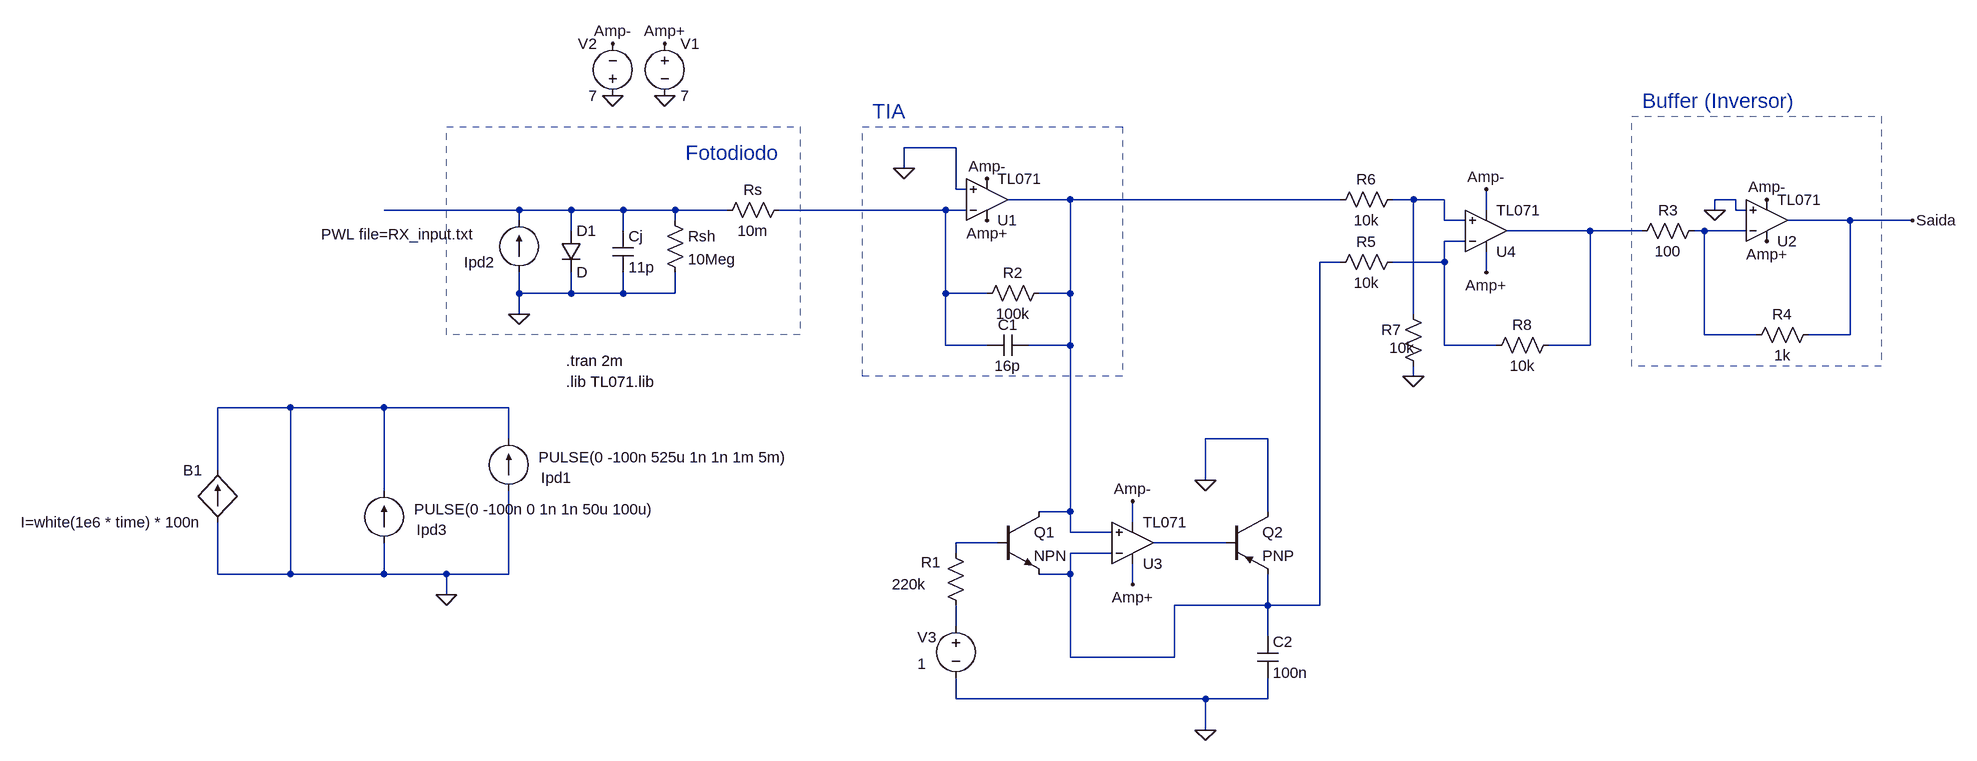
[diagram p0: schematic adaptative_receptor_manual.asc]
adaptative_receptor_manual.asc, the LTspice schematic file:
Version 4
SHEET 1 1100 900
WIRE -1680 -64 -1760 -64
WIRE -1760 -32 -1760 -64
WIRE -1680 0 -1680 -64
WIRE -1664 0 -1680 0
WIRE -1504 16 -1600 16
WIRE -1088 16 -1504 16
WIRE -976 16 -1008 16
WIRE -928 16 -976 16
WIRE -480 16 -512 16
WIRE -2352 32 -2560 32
WIRE -2272 32 -2352 32
WIRE -2192 32 -2272 32
WIRE -2112 32 -2192 32
WIRE -2032 32 -2112 32
WIRE -1696 32 -1952 32
WIRE -1664 32 -1696 32
WIRE -864 32 -864 0
WIRE -512 32 -512 16
WIRE -480 32 -480 16
WIRE -464 32 -480 32
WIRE -2352 48 -2352 32
WIRE -2112 48 -2112 32
WIRE -928 48 -928 16
WIRE -896 48 -928 48
WIRE -304 48 -400 48
WIRE -208 48 -304 48
WIRE -2272 64 -2272 32
WIRE -2192 64 -2192 32
WIRE -704 64 -832 64
WIRE -624 64 -704 64
WIRE -528 64 -544 64
WIRE -464 64 -528 64
WIRE -896 80 -928 80
WIRE -1088 112 -1120 112
WIRE -928 112 -928 80
WIRE -928 112 -1008 112
WIRE -864 128 -864 96
WIRE -2352 160 -2352 128
WIRE -2272 160 -2272 128
WIRE -2272 160 -2352 160
WIRE -2192 160 -2192 128
WIRE -2192 160 -2272 160
WIRE -2112 160 -2112 128
WIRE -2112 160 -2192 160
WIRE -1696 160 -1696 32
WIRE -1632 160 -1696 160
WIRE -1504 160 -1504 16
WIRE -1504 160 -1552 160
WIRE -2352 192 -2352 160
WIRE -976 192 -976 16
WIRE -528 224 -528 64
WIRE -448 224 -528 224
WIRE -304 224 -304 48
WIRE -304 224 -368 224
WIRE -1696 240 -1696 160
WIRE -1632 240 -1696 240
WIRE -1504 240 -1504 160
WIRE -1504 240 -1568 240
WIRE -928 240 -928 112
WIRE -848 240 -928 240
WIRE -704 240 -704 64
WIRE -704 240 -768 240
WIRE -976 288 -976 272
WIRE -2704 336 -2816 336
WIRE -2560 336 -2704 336
WIRE -2368 336 -2560 336
WIRE -2368 384 -2368 336
WIRE -1200 384 -1296 384
WIRE -2816 432 -2816 336
WIRE -1296 448 -1296 384
WIRE -2560 464 -2560 336
WIRE -1504 496 -1504 240
WIRE -1504 496 -1552 496
WIRE -1200 496 -1200 384
WIRE -1408 512 -1408 480
WIRE -1504 528 -1504 496
WIRE -1440 528 -1504 528
WIRE -1616 544 -1680 544
WIRE -1264 544 -1376 544
WIRE -1680 560 -1680 544
WIRE -1440 560 -1504 560
WIRE -2816 592 -2816 512
WIRE -2704 592 -2704 336
WIRE -2704 592 -2816 592
WIRE -2560 592 -2560 544
WIRE -2560 592 -2704 592
WIRE -2464 592 -2560 592
WIRE -2368 592 -2368 464
WIRE -2368 592 -2464 592
WIRE -1504 592 -1504 560
WIRE -1504 592 -1552 592
WIRE -1408 608 -1408 576
WIRE -2464 624 -2464 592
WIRE -1200 640 -1200 592
WIRE -1200 640 -1344 640
WIRE -1120 640 -1120 112
WIRE -1120 640 -1200 640
WIRE -1680 672 -1680 640
WIRE -1200 688 -1200 640
WIRE -1504 720 -1504 592
WIRE -1344 720 -1344 640
WIRE -1344 720 -1504 720
WIRE -1680 784 -1680 752
WIRE -1296 784 -1680 784
WIRE -1200 784 -1200 752
WIRE -1200 784 -1296 784
WIRE -1296 832 -1296 784
FLAG -2128 -224 Amp+
FLAG -2128 -144 0
FLAG -2208 -224 Amp-
FLAG -2208 -144 0
FLAG -1632 48 Amp+
FLAG -1632 -16 Amp-
FLAG -1760 -32 0
FLAG -432 80 Amp+
FLAG -432 16 Amp-
FLAG -512 32 0
FLAG -2352 192 0
FLAG -1408 480 Amp-
FLAG -864 0 Amp-
FLAG -1408 608 Amp+
FLAG -864 128 Amp+
FLAG -976 288 0
FLAG -1296 832 0
FLAG -1296 448 0
FLAG -2464 624 0
FLAG -208 48 Saida
SYMBOL OpAmps\\opamp2 -1632 80 M180
SYMATTR InstName U1
SYMATTR Value TL071
SYMBOL voltage -2128 -240 R0
WINDOW 123 0 0 Left 0
WINDOW 39 0 0 Left 0
SYMATTR InstName V1
SYMATTR Value 7
SYMBOL voltage -2208 -128 R180
WINDOW 0 24 96 Left 2
WINDOW 3 24 16 Left 2
WINDOW 123 0 0 Left 0
WINDOW 39 0 0 Left 0
SYMATTR InstName V2
SYMATTR Value 7
SYMBOL res -1536 144 R90
WINDOW 0 0 56 VBottom 2
WINDOW 3 32 56 VTop 2
SYMATTR InstName R2
SYMATTR Value 100k
SYMBOL res -528 48 R90
WINDOW 0 0 56 VBottom 2
WINDOW 3 32 56 VTop 2
SYMATTR InstName R3
SYMATTR Value 100
SYMBOL OpAmps\\opamp2 -432 112 M180
SYMATTR InstName U2
SYMATTR Value TL071
SYMBOL res -464 240 R270
WINDOW 0 32 56 VTop 2
WINDOW 3 0 56 VBottom 2
SYMATTR InstName R4
SYMATTR Value 1k
SYMBOL diode -2288 64 R0
SYMATTR InstName D1
SYMBOL cap -2208 64 R0
SYMATTR InstName Cj
SYMATTR Value 11p
SYMBOL res -2128 32 R0
SYMATTR InstName Rsh
SYMATTR Value 10Meg
SYMBOL res -1936 16 R90
WINDOW 0 0 56 VBottom 2
WINDOW 3 32 56 VTop 2
SYMATTR InstName Rs
SYMATTR Value 10m
SYMBOL cap -1568 224 R90
WINDOW 0 0 32 VBottom 2
WINDOW 3 32 32 VTop 2
SYMATTR InstName C1
SYMATTR Value 16p
SYMBOL npn -1616 496 R0
SYMATTR InstName Q1
SYMBOL pnp -1264 496 R0
SYMATTR InstName Q2
SYMBOL OpAmps\\opamp2 -1408 608 M180
SYMATTR InstName U3
SYMATTR Value TL071
SYMBOL cap -1216 688 R0
SYMATTR InstName C2
SYMATTR Value 100n
SYMBOL res -1696 544 R0
WINDOW 0 -38 30 Left 2
WINDOW 3 -82 64 Left 2
SYMATTR InstName R1
SYMATTR Value 220k
SYMBOL voltage -1680 656 R0
WINDOW 0 -59 33 Left 2
WINDOW 3 -59 74 Left 2
SYMATTR InstName V3
SYMATTR Value 1
SYMBOL OpAmps\\opamp2 -864 128 M180
SYMATTR InstName U4
SYMATTR Value TL071
SYMBOL res -1104 128 R270
WINDOW 0 32 56 VTop 2
WINDOW 3 0 56 VBottom 2
SYMATTR InstName R5
SYMATTR Value 10k
SYMBOL res -1104 32 R270
WINDOW 0 32 56 VTop 2
WINDOW 3 0 56 VBottom 2
SYMATTR InstName R6
SYMATTR Value 10k
SYMBOL res -992 176 R0
WINDOW 0 -33 40 Left 2
WINDOW 3 -21 68 Left 2
SYMATTR InstName R7
SYMATTR Value 10k
SYMBOL res -752 224 R90
WINDOW 0 0 56 VBottom 2
WINDOW 3 32 56 VTop 2
SYMATTR InstName R8
SYMATTR Value 10k
SYMBOL current -2560 544 R180
WINDOW 3 -46 52 Right 2
WINDOW 123 0 0 Left 0
WINDOW 39 0 0 Left 0
WINDOW 0 -50 20 Right 2
SYMATTR Value PULSE(0 -100n 0 1n 1n 50u 100u)
SYMATTR InstName Ipd3
SYMBOL current -2368 464 R180
WINDOW 3 -46 52 Right 2
WINDOW 123 0 0 Left 0
WINDOW 39 0 0 Left 0
WINDOW 0 -50 20 Right 2
SYMATTR Value PULSE(0 -100n 525u 1n 1n 1m 5m)
SYMATTR InstName Ipd1
SYMBOL bi -2816 512 R180
WINDOW 0 24 80 Left 2
WINDOW 3 24 0 Left 2
SYMATTR InstName B1
SYMATTR Value I=white(1e6 * time) * 100n
SYMBOL current -2352 128 R180
WINDOW 3 305 59 Right 2
WINDOW 123 0 0 Left 0
WINDOW 39 0 0 Left 0
WINDOW 0 85 16 Right 2
SYMATTR Value PWL file=RX_input.txt
SYMATTR InstName Ipd2
TEXT -2280 264 Left 2 !.tran 2m
TEXT -2280 296 Left 2 !.lib TL071.lib
TEXT -2096 -56 Left 3 ;Fotodiodo
TEXT -1808 -120 Left 3 ;TIA
TEXT -624 -136 Left 3 ;Buffer (Inversor)
RECTANGLE Normal -1424 288 -1824 -96 2
RECTANGLE Normal -256 272 -640 -112 2
RECTANGLE Normal -1920 224 -2464 -96 2

The netlist it stands for:
* adaptative_receptor_manual.asc
XU1 0 N004 Amp+ Amp- N001 TL071  ; pins In+ In- V+ V- OUT
V1 Amp+ 0 7
V2 0 Amp- 7
R2 N001 N004 100k
R3 N006 N005 100
XU2 0 N006 Amp+ Amp- Saida TL071  ; pins In+ In- V+ V- OUT
R4 N006 Saida 1k
D1 N003 0 D
Cj N003 0 11p
Rsh N003 0 10Meg
Rs N004 N003 10m
C1 N001 N004 16p
Q1 N001 N009 N008 0 NPN
Q2 0 N010 N008 0 PNP
XU3 N001 N008 Amp+ Amp- N010 TL071  ; pins In+ In- V+ V- OUT
C2 N008 0 100n
R1 N009 N011 220k
V3 N011 0 1
XU4 N002 N007 Amp+ Amp- N005 TL071  ; pins In+ In- V+ V- OUT
R5 N008 N007 10k
R6 N001 N002 10k
R7 N002 0 10k
R8 N005 N007 10k
Ipd3 0 0 PULSE(0 -100n 0 1n 1n 50u 100u)
Ipd1 0 0 PULSE(0 -100n 525u 1n 1n 1m 5m)
B1 0 0 I=white(1e6 * time) * 100n
Ipd2 0 N003 PWL file=RX_input.txt
.model D D
.lib standard.dio
.model NPN NPN
.model PNP PNP
.lib standard.bjt
.tran 2m
.lib TL071.lib
* Fotodiodo
* TIA
* Buffer (Inversor)
.backanno
.end